# Altium project TSAV Junction PCB.PrjPcb
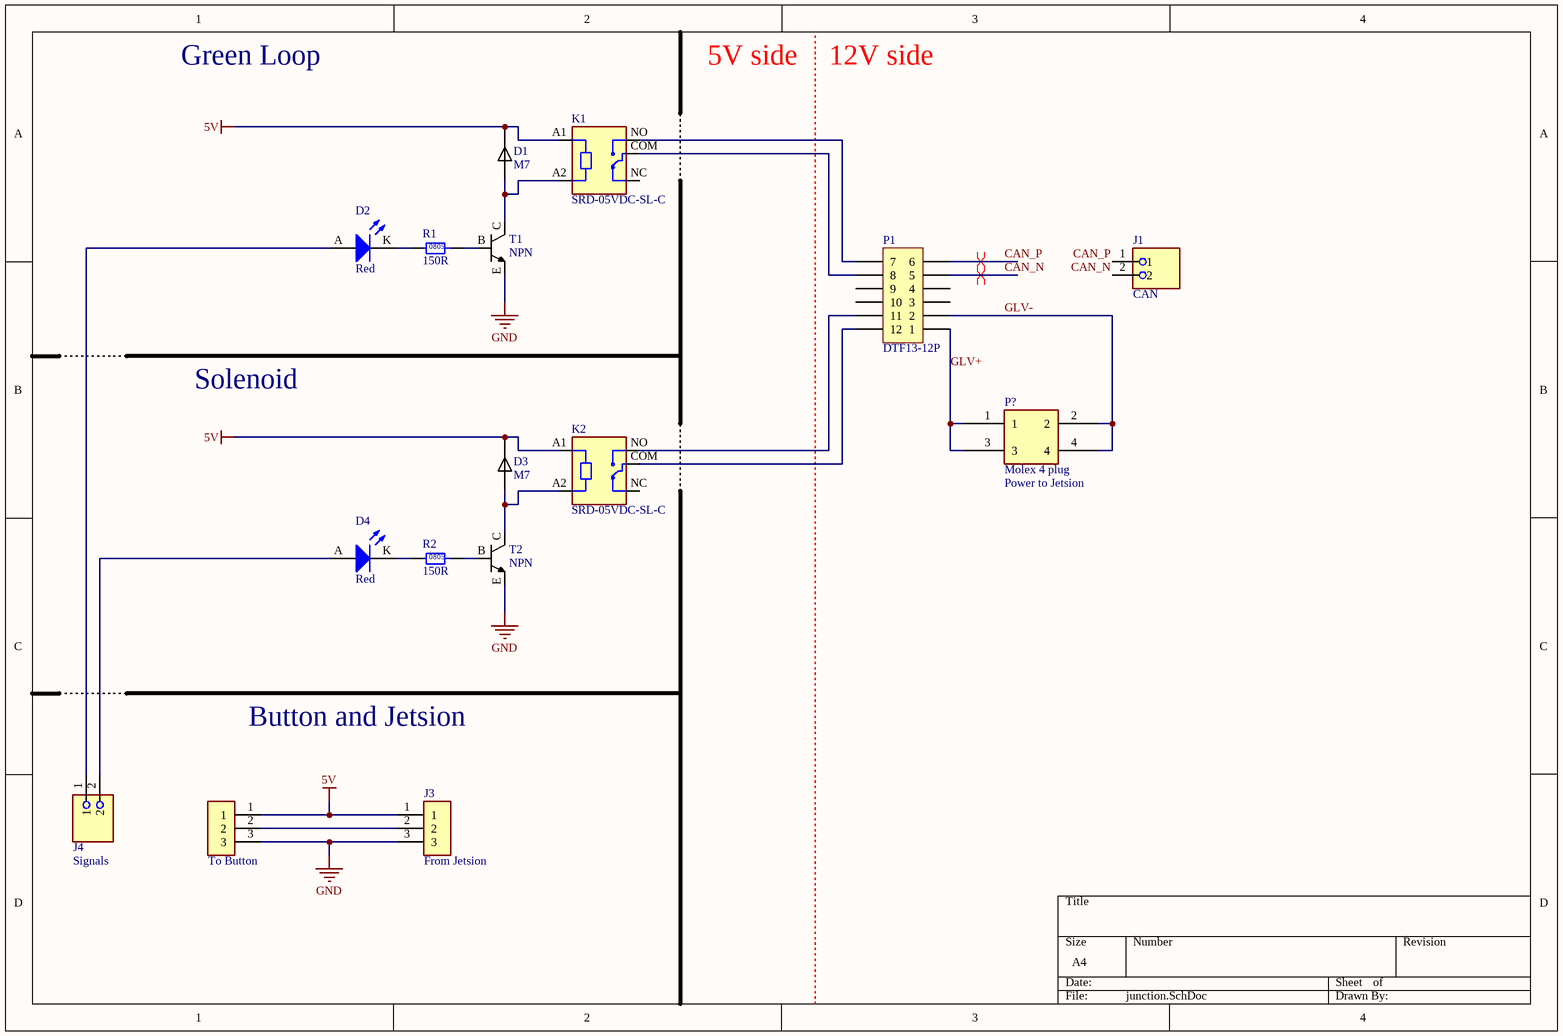
[diagram p0: junction.SchDoc]
1 sheet, 16 parts. Net scope: global (net labels, ports and power ports of the same name join across sheets).
Board file: juncrionPCBTSAV.PcbDoc

## Sheet junction.SchDoc
size A4; SheetNumber: 1; SheetTotal: 1

### Parts
D1  M7  [DIOM505270X240]
D2  Red  [0805 LED]
D3  M7  [DIOM505270X240]
D4  Red  [0805 LED]
J1  CAN  [PHOENIX_1935776]
J2  Power to Jetsion  [FP-39288040-MFG]  (part A of 2)
J3  From Jetsion  [TE_282837-3]
J4  Signals  [PHOENIX_1935776]
K1  SRD-05VDC-SL-C  [RELAY_SRD-05VDC-SL-C]
K2  SRD-05VDC-SL-C  [RELAY_SRD-05VDC-SL-C]
P1  DTF13-12P  [DTF13-12P]
R1  150R  [0805]
R2  150R  [0805]
T1  NPN  [PCBComponent_1]
T2  NPN  [PCBComponent_1]
  To Button  [TE_282837-3]

### Nets
5V: D1.C D3.C J3.1 K1.A1 K2.A1 .1
GND: J3.3 T1.E T2.E .3
CAN_N: J1.2 P1.5
CAN_P: J1.1 P1.6
GLV+: J2.1 J2.3 P1.1
GLV-: J2.2 J2.4 P1.2
NetD1_A: D1.A K1.A2 T1.C
NetD2_A: D2.A J4.1
NetD2_K: D2.K R1.1
NetD3_A: D3.A K2.A2 T2.C
NetD4_A: D4.A J4.2
NetD4_K: D4.K R2.1
NetJ3_2: J3.2 .2
NetK1_COM: K1.COM P1.8
NetK1_NO: K1.NO P1.7
NetK2_COM: K2.COM P1.12
NetK2_NO: K2.NO P1.11
NetR1_2: R1.2 T1.B
NetR2_2: R2.2 T2.B

Not connected (* = marked no-connect by the designer): K1 NC; K2 NC; P1 3 4 9 10

### Layout directives
differential pair: CAN_N, CAN_P

### Notes on the sheet
- Green Loop
- 5V side
- 12V side
- Solenoid
- Button and Jetsion
- (in symbol CMP-04776-000078-1, part A) P?; Molex 4 plug
- (in symbol RC0805FR07150RL) 0805

### Library data of the parts
D1 D3 = M7: Diode, SMA, 1000V, 1A, 150°C; MF: Diotec Semiconductor; SnapEDA_Link: https://www.snapeda.com/parts/M7/Diotec/view-part/?ref=snap; Package: DO-214AC Diotec; Value: *; MP: M7; Check_prices: https://www.snapeda.com/parts/M7/Diotec/view-part/?ref=eda
D2 D4 = SML-210LTT86: Red LED Indication - Discrete 1.75V 0805 (2012 Metric); Manufacturer: ROHM Semiconductor; Part Number: SML-210LTT86; Colour: Red; Digikey Part Number: 511-1286-1-ND
J1 J4 = 1935776: Package: None; Price: None; Value: *; MP: 1935776; Availability: Unavailable
J2 = CMP-04776-000078-1: CONN HEADER VERT 4POS 4.2MM; Manufacturer Part Number: 39288040; Manufacturer: Molex; Number Of Contacts: 4; Conn Gender: Male; Voltage Rating: 600V; Current Rating: 9A; Conn Orientation: Vertical; Height: 13.1mm; RoHS: TRUE; Temperature Range High: +105°C; Contact Material: Tin,Nickel; Temperature: -40°C to +105°C; Number Of Rows: 2; ComponentLink2Description: Datasheet; Automotive: No; Pitch: 4.2mm; Device Class L1: Connectors; ComponentLink2URL: https://www.molex.com/webdocs/datasheets/pdf/en-us/0039288040_PCB_HEADERS.pdf; Octopart: https://octopart.com/39-28-8040-molex-25241; Footprint Url: https://www.molex.com/pdm_docs/sd/039288040_sd.pdf; Mouser Description: Conn Power HDR 4 POS 4.2mm Solder ST Thru-Hole 4 Terminal 1 Port Mini-Fit Jrá??Bag; Device Class L2: Headers and Wire Housings; Lead Free: Yes; Digikey Description: CONN HEADER VERT 4POS 4.2MM; Package: 0; Device Class L3: unset; Category: Conn; Temperature Range Low: -40°C
J3  = 282837-3: TERMI-BLOK PCB MOUNT 3P
K1 K2 = SRD-05VDC-SL-C: 5V Trigger Relay Module For Arduino And Raspberry Pi 5V Trigger Relay Module For Arduino And Raspberry Pi; MF: Songle Relay; Check_prices: https://www.snapeda.com/parts/SRD-05VDC-SL-C/Songle+Relay/view-part/?ref=eda; Value: *; Availability: Not in stock; Price: None; Package: NON STANDARD-5 Songle Relay; MP: SRD-05VDC-SL-C; SnapEDA_Link: https://www.snapeda.com/parts/SRD-05VDC-SL-C/Songle+Relay/view-part/?ref=snap
P1 = DTF13-12P: Positions: 12; Pitch: 4.45mm; Angle: 90; Flange: No; Contact: Copper Alloy; Part Number: DTF13-12P; Row Spacing: 4.45mm; Digikey Part Number: 1734-1861-ND; Digikey Link: https://www.digikey.com/products/en?keywords=dtf13-12pa
R1 R2 = RC0805FR07150RL: Manufacturer: YAGEO; Tolerance: 0.01; Rated Power: 0.125W; Part Number: RC0805FR07150RL; Value: 150R; Material: FR-07; Digikey Part Number: 311-150CRCT-ND